# Altium schematic sheet Show version information.SchDoc
size A4; Date: 2025/12/2; DrawnBy: 付浩为; Revision: V1.00; SheetNumber: 1; SheetTotal: 2; Model: GS_4CH_Motherboard; Size: A4; Department: R&D
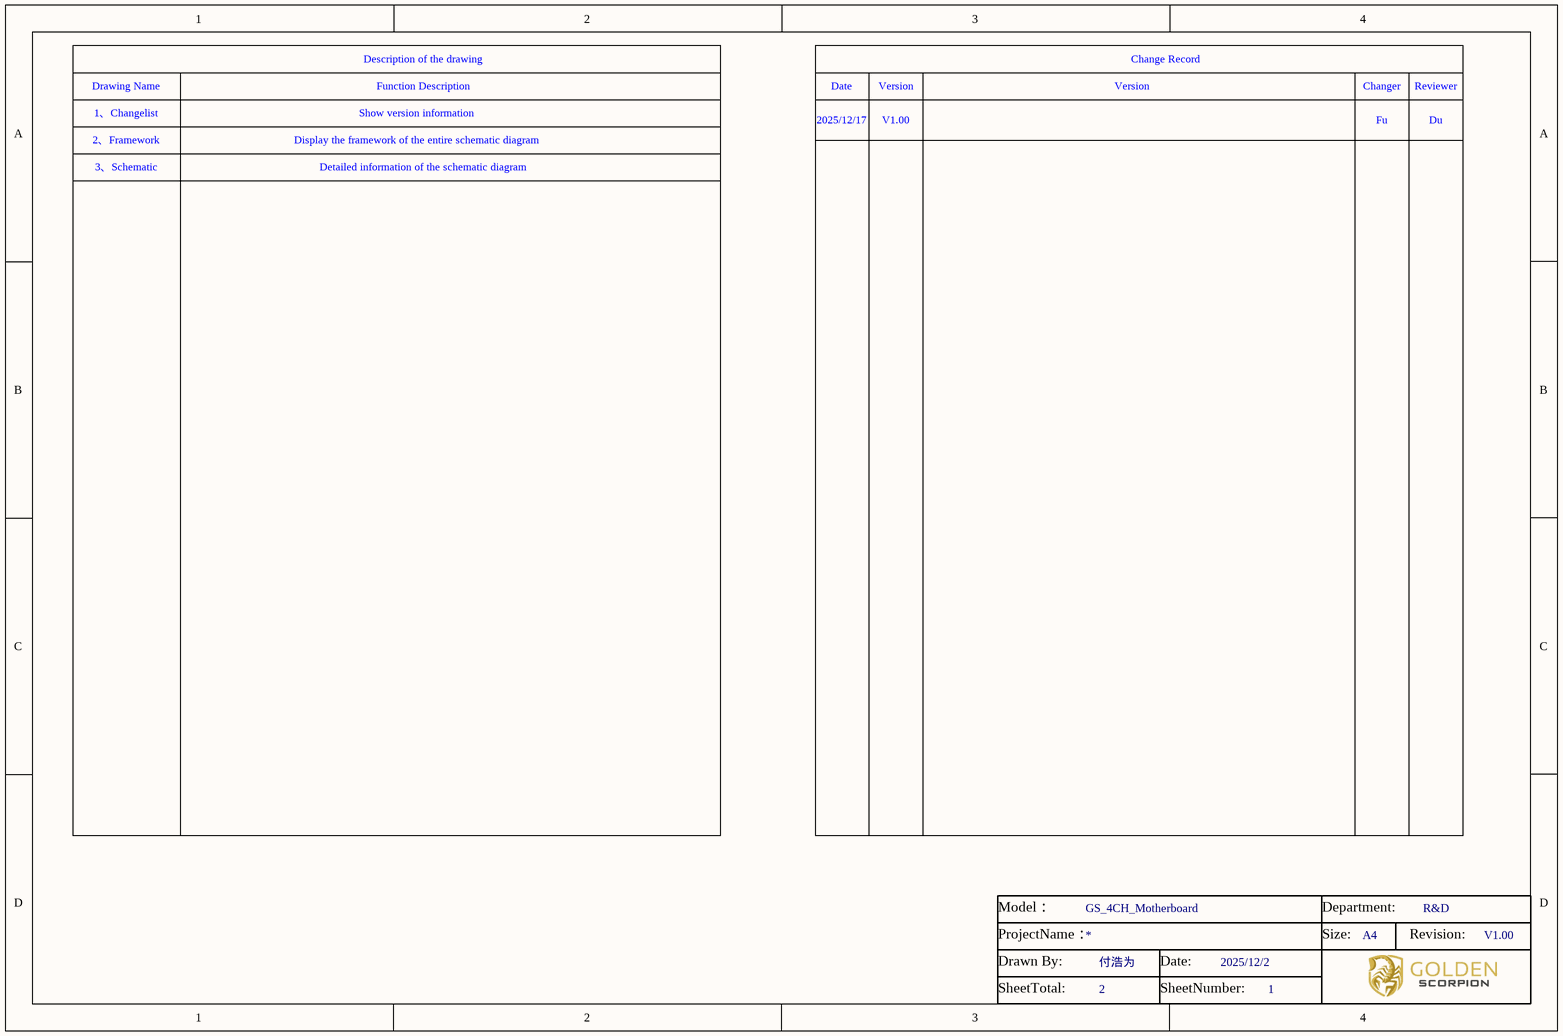
[diagram p0: Show version information.SchDoc]

## Notes on the sheet
- Drawing Name
- 1、Changelist
- Show version information
- Description of the drawing
- Function Description
- Date
- 2025/12/17
- Version
- V1.00
- Change Record
- Changer
- Fu
- Reviewer
- Du
- 2、Framework
- 3、Schematic
- Display the framework of the entire schematic diagram
- Detailed information of the schematic diagram
- Model：
- Department:
- ProjectName：
- Drawn By:
- Date:
- Size:
- Revision:
- SheetTotal:
- SheetNumber: